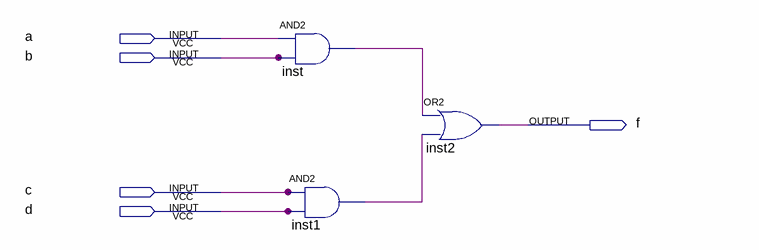
[diagram p0: schematic sheet]
// Quartus schematic Part_II.bdf as structural Verilog: 3 symbols, 5 pins
module Part_II (
  input  a,
  input  b,
  input  c,
  input  d,
  output f
);

  wire inst1_out, inst_out;

  and inst (inst_out, a, b);
  and inst1 (inst1_out, c, d);
  or inst2 (f, inst_out, inst1_out);
endmodule
